# Altium schematic sheet 2_MCU.schdoc
size 309 x 223 mm; Symbol: Sheet-Symbol_A4; Device: Sheet-Symbol_A4; Company: EasyEDA.com; Drawed: EasyEDA Pro; Reviewed: EasyEDA Pro; Version: V0.1; Page Size: A4; @Project Name: TUD-EnergyHarvestingConsole_2022-08-29_17-01-09; @Page Count: 2; @Update Date: 2023-01-30; @Create Date: 2023-01-30; @Schematic Name: TUD-EHC-CrankModule_3; Part Number: JLCPCB-002; @Page No: 2; @Page Name: MCU
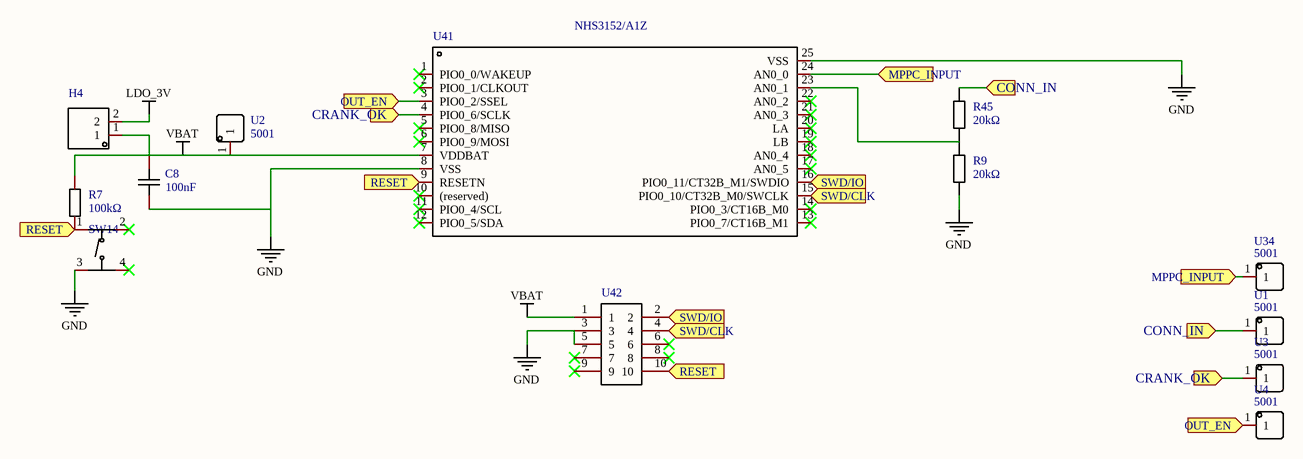
[diagram p0: 2_MCU.schdoc]

## Parts
C8  100nF  [C0603]
H4  HDR-M_2.54_1x2P  [HDR-TH_2P-P2.54-V-M-1]  (value not drawn)
R7  100kΩ  [R0603]
R9  20kΩ  [R0603]
R45  20kΩ  [R0603]
SW14  TS-1187A-B-A-B  [SW-SMD_4P-L5.1-W5.1-P3.70-LS6.5-TL-2]  (value not drawn)
U1  5001  [TEST-TH_BD2.54-P1.39]
U2  5001  [TEST-TH_BD2.54-P1.39]
U3  5001  [TEST-TH_BD2.54-P1.39]
U4  5001  [TEST-TH_BD2.54-P1.39]
U34  5001  [TEST-TH_BD2.54-P1.39]
U41  NHS3152/A1Z  [QFN-24_L4.0-W4.0-P0.50-BL-EP2.6]
U42  20021121-00010T4LF  [HDR-SMD_10P-P1.27-V-M-R2-C5-S1.27-LS5.5]  (value not drawn)

## Ports
CONN_IN (in), CRANK_OK (in), MPPC_INPUT (in), OUT_EN (in), RESET (in), SWD/CLK (in), SWD/IO (in)

## Nets
GND: C8.2 R9.2 SW14.3(C) U41.8(VSS) U41.25(VSS) U42.3 U42.5
LDO_3V: H4.2
VBAT: C8.1 H4.1 R7.1 U2.1 U41.7(VDDBAT) U42.1
CONN_IN: R45.1 U1.1 ; port CONN_IN
CRANK_OK: U3.1 U41.4(PIO0_6/SCLK) ; port CRANK_OK
MPPC_INPUT: U34.1 U41.24(AN0_0) ; port MPPC_INPUT
OUT_EN: U4.1 U41.3(PIO0_2/SSEL) ; port OUT_EN
RESET: R7.2 SW14.1(A) U41.9(RESETN) U42.10 ; port RESET
SWD/CLK: U41.15(PIO0_10/CT32B_M0/SWCLK) U42.4 ; port SWD/CLK
SWD/IO: U41.16(PIO0_11/CT32B_M1/SWDIO) U42.2 ; port SWD/IO
NetR9_1: R9.1 R45.2 U41.23(AN0_1)

Not connected (* = marked no-connect by the designer): SW14 2(B)* 4(D)*; U41 1(PIO0_0/WAKEUP)* 2(PIO0_1/CLKOUT)* 5(PIO0_8/MISO)* 6(PIO0_9/MOSI)* 10((reserved))* 11(PIO0_4/SCL)* 12(PIO0_5/SDA)* 13(PIO0_7/CT16B_M1)* 14(PIO0_3/CT16B_M0)* 17(AN0_5)* 18(AN0_4)* 19(LB)* 20(LA)* 21(AN0_3)* 22(AN0_2)*; U42 6* 7* 8* 9*

## Notes on the sheet
- 1
- 2
- 3
- 4
- 5
- 6
- A
- B
- C
- Schematic
- TUD-EHC-CrankModule_3
- Create Date
- Update Date
- 2023-01-30
- Reviewed
- Drawed
- Page
- EasyEDA Pro
- MCU
- Part Number
- TUD-EnergyHarvestingConsole_2022-08-29_17-01-09
- JLCPCB-002
- D
- VER
- SIZE
- PAGE
- OF
- V0.1
- A4
- EasyEDA.com

## Library data of the parts
C8 = CC0603KRX7R9BB104: Manufacturer: YAGEO; Convert to PCB: yes; Name: 100nF; Symbol: 100nF; Device: CC0603KRX7R9BB104; Supplier: LCSC; Manufacturer Part: CC0603KRX7R9BB104; Supplier Part: C14663; JLCPCB Part Class: Basic; Add into BOM: yes; Origin Footprint: C0603
H4 = HDR-M_2.54_1x2P: Symbol: 210S-1*2P L=11.6MMGold-plated black; Convert to PCB: yes; Device: HDR-M_2.54_1x2P; Add into BOM: yes; Supplier Footprint: Through
R7 = 0603WAF1003T5E: Type:Thick Film Resistors Resistance: Tolerance:±1% Tolerance:±1% Power(Watts): Temperature Coefficient:±100ppm/℃ Temperature Coefficient:±100ppm/℃ Overload Voltage (Max): Operating Temperature Range:-55℃~+155℃ Operating Temperature Range:-55℃~+155℃; Manufacturer: UNI-ROYAL(厚声); Add into BOM: yes; Tolerance: ±1%; Name: 100kΩ; Symbol: 0603WAF1003T5E; Device: 0603WAF1003T5E; LCSC Part Name: 100kΩ ±1% 100mW; Supplier Part: C25803; Manufacturer Part: 0603WAF1003T5E; Supplier Footprint: 0603; JLCPCB Part Class: Basic Part; Datasheet: https://atta.szlcsc.com/upload/public/pdf/source/20200306/C422600_1E6D84923E4A46A82E41ADD87F860B5C.pdf; Supplier: LCSC; Convert to PCB: yes; Type: Thick Film Resistors; Value: 100kΩ; Temperature Coefficient: ±100ppm/℃; Operating Temperature Range: -55℃~+155℃
R9 R45 = 0603WAF2002T5E: Manufacturer: UniOhm; Resistance: 20K; Convert to PCB: yes; Name: 20kΩ; Symbol: 20kΩ; Device: 0603WAF2002T5E; Supplier: LCSC; Manufacturer Part: 0603WAF2002T5E; Supplier Part: C4184; JLCPCB Part Class: Basic Part; Add into BOM: yes; Origin Footprint: R0603
SW14 = TS-1187A-B-A-B: Contact Current:50mA Voltage Rating (DC):12V Insulation Resistance:- Circuit:SPST Mounting Style:Brick nogging Actuator Style:Round Button Actuator/Cap Color:金色 With Lamp:No Operating Force:160gf Mechanical Life:100000 Operating Temperature:-30℃~+85℃ Oper; Manufacturer: XKB Connectivity(中国星坤); Add into BOM: yes; Contact Current: 50mA; Voltage Rating (DC): 12V; Circuit: SPST; Actuator/Cap Color: 金色; With Lamp: No; Operating Force: 160gf; Mechanical Life: 100000; Switch Length: 5.1mm; Switch Height: 1.5mm; Name: TS-1187A-B-A-B; Symbol: TS-1187A-B-A-B; Device: TS-1187A-B-A-B; LCSC Part Name: 5.1*5.1*1.5 防水金属头160gf; Supplier Part: C318884; Manufacturer Part: TS-1187A-B-A-B; Supplier Footprint: SMD; JLCPCB Part Class: Basic Part; Datasheet: https://atta.szlcsc.com/upload/public/pdf/source/20200227/C318884_1F20165719E1C4CAA3E10C4C359C6E26.pdf; Supplier: LCSC; Convert to PCB: yes; Insulation Resistance: -; Mounting Style: Brick nogging; Actuator Style: Round Button; Operating Temperature: -30℃~+85℃; Switch Width: 5.1mm; Strike Gundam: NO
U1-U4 U34 = 5001: Manufacturer: Keystone; Convert to PCB: yes; Name: 5001; Symbol: 5001; Device: 5001; Supplier: LCSC; Supplier Part: C238122; Manufacturer Part: 5001; JLCPCB Part Class: Extended Part; Add into BOM: yes; Origin Footprint: TEST-TH_BD2.54-P1.39
U41 = NHS3152/A1Z: Manufacturer: NXP(恩智浦); Add into BOM: yes; Name: NHS3152/A1Z; Symbol: NHS3152/A1Z; Device: NHS3152/A1Z; LCSC Part Name: NHS3152/A1Z; Supplier Part: C2654832; Manufacturer Part: NHS3152/A1Z; Supplier Footprint: HVQFN-24(4x4); JLCPCB Part Class: Extended Part; Datasheet: https://atta.szlcsc.com/upload/public/pdf/source/20210612/5160445B57F69F44302DE5787B3ADA6D.pdf; Supplier: LCSC; Convert to PCB: yes
U42 = 20021121-00010T4LF: Manufacturer: Amphenol; Add into BOM: yes; Name: 20021121-00010T4LF; Symbol: 20021121-00010T4LF; Device: 20021121-00010T4LF; LCSC Part Name: 2x5P P=1.27mm; Supplier Part: C598540; Manufacturer Part: 20021121-00010T4LF; Supplier Footprint: SMD,P=1.27mm; JLCPCB Part Class: Extended Part; Datasheet: https://atta.szlcsc.com/upload/public/pdf/source/20210513/C598542_FDB1876580D2C5E95E826F89938B3DC0.pdf; Supplier: LCSC; Convert to PCB: yes